# Altium project Control_Card.PrjPcb
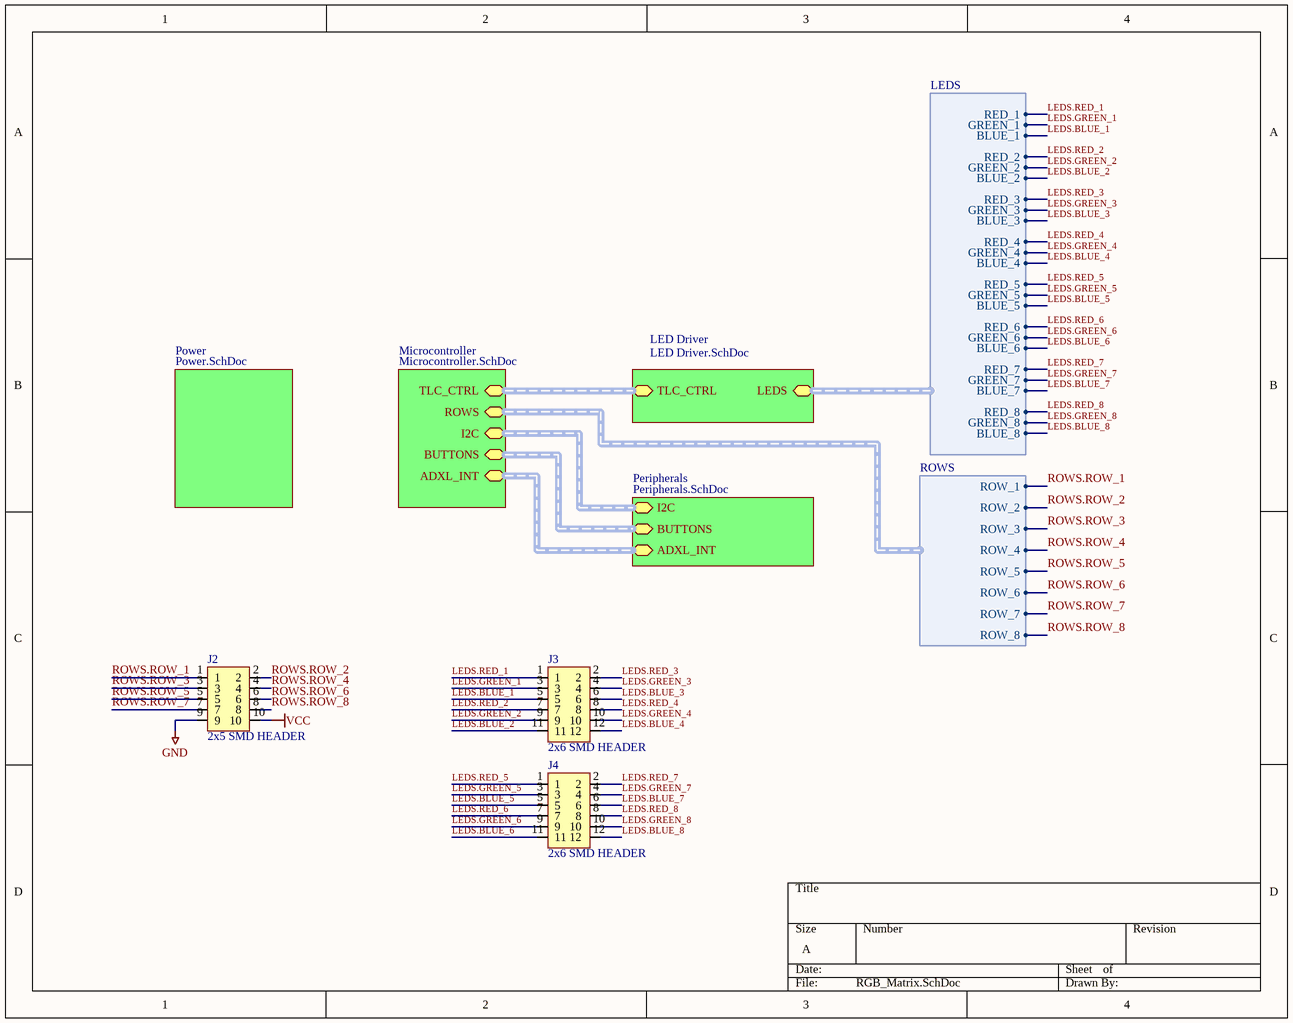
[diagram p0: RGB_Matrix.SchDoc]
4 sheets, 18 parts. Net scope: hierarchical (ports join the sheet entries above them; power ports are global).
Board file: RGB_Matrix.PcbDoc
Sheets:
  RGB_Matrix.SchDoc
    LED Driver = LED Driver.SchDoc
    Microcontroller = Microcontroller.SchDoc
    Power = Power.SchDoc

## Sheet RGB_Matrix.SchDoc
size A

### Parts
J2  2x5 SMD HEADER  [2x5 SMD HEADER]
J3  2x6 SMD HEADER  [2x6 SMD HEADER]
J4  2x6 SMD HEADER  [2x6 SMD HEADER]

### Sub-sheets
LED Driver = LED Driver.SchDoc: TLC_CTRL (harness TLC_CTRL), LEDS (harness LEDS)
Microcontroller = Microcontroller.SchDoc: TLC_CTRL (harness TLC_CTRL), ROWS (harness ROWS), I2C (harness I2C), ADXL_INT (harness ADXL_INT), BUTTONS (harness BUTTONS)
Peripherals = Peripherals.SchDoc (file not in this document): I2C (harness I2C), ADXL_INT (harness ADXL_INT), BUTTONS (harness BUTTONS)
Power = Power.SchDoc: no entries

### Harnesses
LEDS: BLUE_1, BLUE_2, BLUE_3, BLUE_4, BLUE_5, BLUE_6, BLUE_7, GREEN_1, GREEN_2, GREEN_3, GREEN_4, GREEN_5, GREEN_6, GREEN_7, GREEN_8, RED_1, RED_2, RED_3, RED_4, RED_5, RED_6, RED_7, RED_8, BLUE_8
ROWS: ROW_1, ROW_2, ROW_3, ROW_4, ROW_5, ROW_6, ROW_7, ROW_8

### Nets
GND: J2.9
VCC: J2.10
LEDS.BLUE_1: J3.5 ; sheet LED Driver/LEDS.BLUE_1
LEDS.BLUE_2: J3.11 ; sheet LED Driver/LEDS.BLUE_2
LEDS.BLUE_3: J3.6 ; sheet LED Driver/LEDS.BLUE_3
LEDS.BLUE_4: J3.12 ; sheet LED Driver/LEDS.BLUE_4
LEDS.BLUE_5: J4.5 ; sheet LED Driver/LEDS.BLUE_5
LEDS.BLUE_6: J4.11 ; sheet LED Driver/LEDS.BLUE_6
LEDS.BLUE_7: J4.6 ; sheet LED Driver/LEDS.BLUE_7
LEDS.BLUE_8: J4.12 ; sheet LED Driver/LEDS.BLUE_8
LEDS.GREEN_1: J3.3 ; sheet LED Driver/LEDS.GREEN_1
LEDS.GREEN_2: J3.9 ; sheet LED Driver/LEDS.GREEN_2
LEDS.GREEN_3: J3.4 ; sheet LED Driver/LEDS.GREEN_3
LEDS.GREEN_4: J3.10 ; sheet LED Driver/LEDS.GREEN_4
LEDS.GREEN_5: J4.3 ; sheet LED Driver/LEDS.GREEN_5
LEDS.GREEN_6: J4.9 ; sheet LED Driver/LEDS.GREEN_6
LEDS.GREEN_7: J4.4 ; sheet LED Driver/LEDS.GREEN_7
LEDS.GREEN_8: J4.10 ; sheet LED Driver/LEDS.GREEN_8
LEDS.RED_1: J3.1 ; sheet LED Driver/LEDS.RED_1
LEDS.RED_2: J3.7 ; sheet LED Driver/LEDS.RED_2
LEDS.RED_3: J3.2 ; sheet LED Driver/LEDS.RED_3
LEDS.RED_4: J3.8 ; sheet LED Driver/LEDS.RED_4
LEDS.RED_5: J4.1 ; sheet LED Driver/LEDS.RED_5
LEDS.RED_6: J4.7 ; sheet LED Driver/LEDS.RED_6
LEDS.RED_7: J4.2 ; sheet LED Driver/LEDS.RED_7
LEDS.RED_8: J4.8 ; sheet LED Driver/LEDS.RED_8
ROWS.ROW_1: J2.1 ; sheet Microcontroller/ROWS.ROW_1
ROWS.ROW_2: J2.2 ; sheet Microcontroller/ROWS.ROW_2
ROWS.ROW_3: J2.3 ; sheet Microcontroller/ROWS.ROW_3
ROWS.ROW_4: J2.4 ; sheet Microcontroller/ROWS.ROW_4
ROWS.ROW_5: J2.5 ; sheet Microcontroller/ROWS.ROW_5
ROWS.ROW_6: J2.6 ; sheet Microcontroller/ROWS.ROW_6
ROWS.ROW_7: J2.7 ; sheet Microcontroller/ROWS.ROW_7
ROWS.ROW_8: J2.8 ; sheet Microcontroller/ROWS.ROW_8

### Buses and harness runs
harness sheet LED Driver/TLC_CTRL = sheet Microcontroller/TLC_CTRL
harness sheet Microcontroller/ADXL_INT = sheet Peripherals/ADXL_INT
harness sheet Microcontroller/BUTTONS = sheet Peripherals/BUTTONS
harness sheet Microcontroller/I2C = sheet Peripherals/I2C

## Sheet LED Driver.SchDoc
size A4
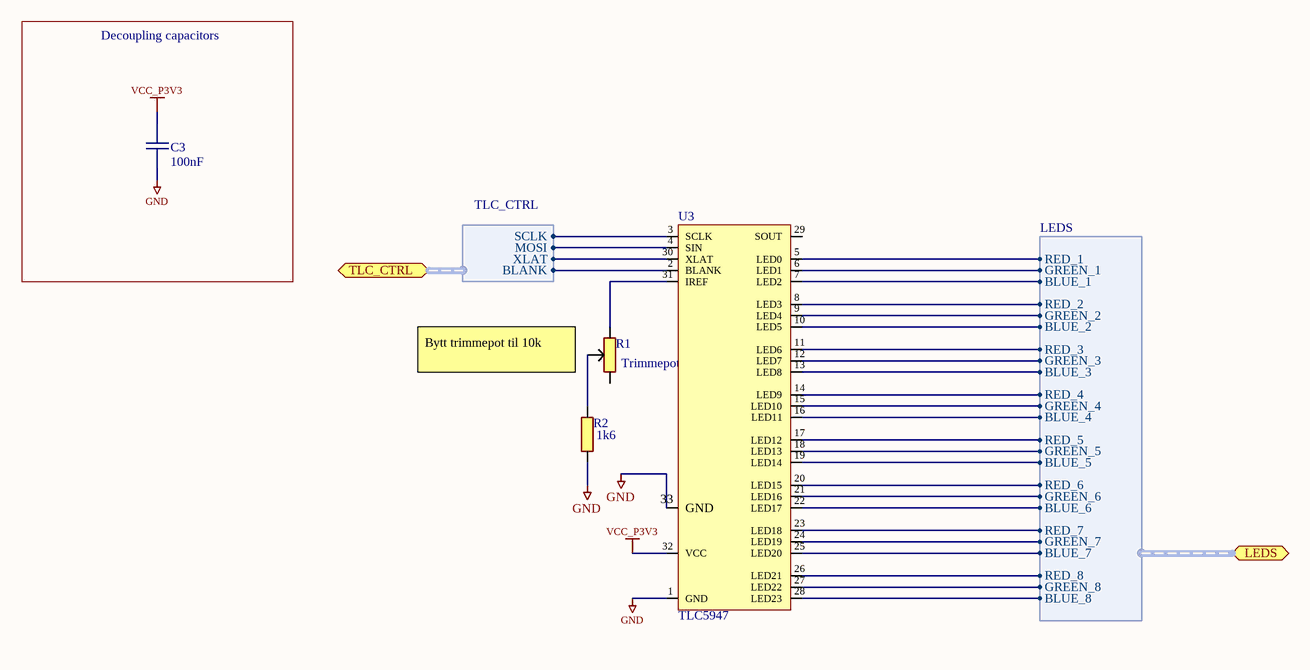
[diagram p1: LED Driver.SchDoc]

### Parts
C3  100nF  [CAPC0603(1608)55_N]
R1  Trimmepot 500ohm  [TRIMPOT_3006P]
R2  1k6  [RESC0603(1608)_N]
U3  TLC5947  [TLC5947]

### Blocks framed on the sheet
Decoupling capacitors: C3

### Ports
LEDS (harness LEDS), TLC_CTRL (harness TLC_CTRL)

### Harnesses
TLC_CTRL: SCLK, MOSI, XLAT, BLANK
LEDS: BLUE_1, BLUE_2, BLUE_3, BLUE_4, BLUE_5, BLUE_6, BLUE_7, GREEN_1, GREEN_2, GREEN_3, GREEN_4, GREEN_5, GREEN_6, GREEN_7, GREEN_8, RED_1, RED_2, RED_3, RED_4, RED_5, RED_6, RED_7, RED_8, BLUE_8

### Nets
GND: C3.1 R2.1 U3.1(GND) U3.33(GND)
VCC_P3V3: C3.2 U3.32(VCC)
LEDS.BLUE_1: U3.7(LED2) ; port LEDS.BLUE_1
LEDS.BLUE_2: U3.10(LED5) ; port LEDS.BLUE_2
LEDS.BLUE_3: U3.13(LED8) ; port LEDS.BLUE_3
LEDS.BLUE_4: U3.16(LED11) ; port LEDS.BLUE_4
LEDS.BLUE_5: U3.19(LED14) ; port LEDS.BLUE_5
LEDS.BLUE_6: U3.22(LED17) ; port LEDS.BLUE_6
LEDS.BLUE_7: U3.25(LED20) ; port LEDS.BLUE_7
LEDS.BLUE_8: U3.28(LED23) ; port LEDS.BLUE_8
LEDS.GREEN_1: U3.6(LED1) ; port LEDS.GREEN_1
LEDS.GREEN_2: U3.9(LED4) ; port LEDS.GREEN_2
LEDS.GREEN_3: U3.12(LED7) ; port LEDS.GREEN_3
LEDS.GREEN_4: U3.15(LED10) ; port LEDS.GREEN_4
LEDS.GREEN_5: U3.18(LED13) ; port LEDS.GREEN_5
LEDS.GREEN_6: U3.21(LED16) ; port LEDS.GREEN_6
LEDS.GREEN_7: U3.24(LED19) ; port LEDS.GREEN_7
LEDS.GREEN_8: U3.27(LED22) ; port LEDS.GREEN_8
LEDS.RED_1: U3.5(LED0) ; port LEDS.RED_1
LEDS.RED_2: U3.8(LED3) ; port LEDS.RED_2
LEDS.RED_3: U3.11(LED6) ; port LEDS.RED_3
LEDS.RED_4: U3.14(LED9) ; port LEDS.RED_4
LEDS.RED_5: U3.17(LED12) ; port LEDS.RED_5
LEDS.RED_6: U3.20(LED15) ; port LEDS.RED_6
LEDS.RED_7: U3.23(LED18) ; port LEDS.RED_7
LEDS.RED_8: U3.26(LED21) ; port LEDS.RED_8
NetR1_2: R1.2 R2.2
NetR1_3: R1.3 U3.31(IREF)
NetU1_14: U3.30(XLAT) ; port TLC_CTRL.XLAT
NetU1_15: U3.4(SIN) ; port TLC_CTRL.MOSI
NetU1_16: U3.2(BLANK) ; port TLC_CTRL.BLANK
NetU1_17: U3.3(SCLK) ; port TLC_CTRL.SCLK

Not connected (* = marked no-connect by the designer): R1 1; U3 29(SOUT)

### Notes on the sheet
- Bytt trimmepot til 10k
- Size:
- Date:
- Title:
- A3
- Revision:
- Sheet
- of
- Author:
- File:

### Library data of the parts
C3 = 3028: X7R 50V 5%; id: 3028; pakke_opprettet_av: 815; leverandor_varenr: 1759122; pris: 1; nokkelord: Kondensator, Capacitor, CAP; produsent: Multikomp; leverandor: Farnell; pakketype: 0603; pakke_opprettet: 18-Feb-15 2:18:13 PM; symbol_opprettet_av: 815; symbol_opprettet: 14-Nov-14 8:19:34 PM; navn: 100nF
R1 = 1365: 15 turn, horizontal; id: 1365; rad: 1; rom: OV; lager_type: Fremlager; dybde: 2; hylle: 7; antall: 50; pakke_opprettet_av: 815; leverandor_varenr: 9352376; pris: 15; nokkelord: trimpot; produsent: Bourns; leverandor: Farnell; pakketype: TH; kolonne: 1; pakke_opprettet: 2/10/2017 3:29:47 PM; symbol_opprettet_av: 815; symbol_opprettet: 11/3/2016 3:34:07 PM; navn: Trimmepot 500ohm
R2 = 3446: 0.1W 1% Thick film resistor; id: 3446; rad: -1; rom: OV; lager_type: Fremlager; dybde: 53; hylle: 6; antall: 100; kolonne: 0; pakke_opprettet_av: 815; pakketype: 0603; pakke_opprettet: 7/8/2014 9:15:30 PM; symbol_opprettet_av: 815; symbol_opprettet: 7/8/2014 9:16:33 PM; navn: 1k6; pris: 0

## Sheet Microcontroller.SchDoc
size A4
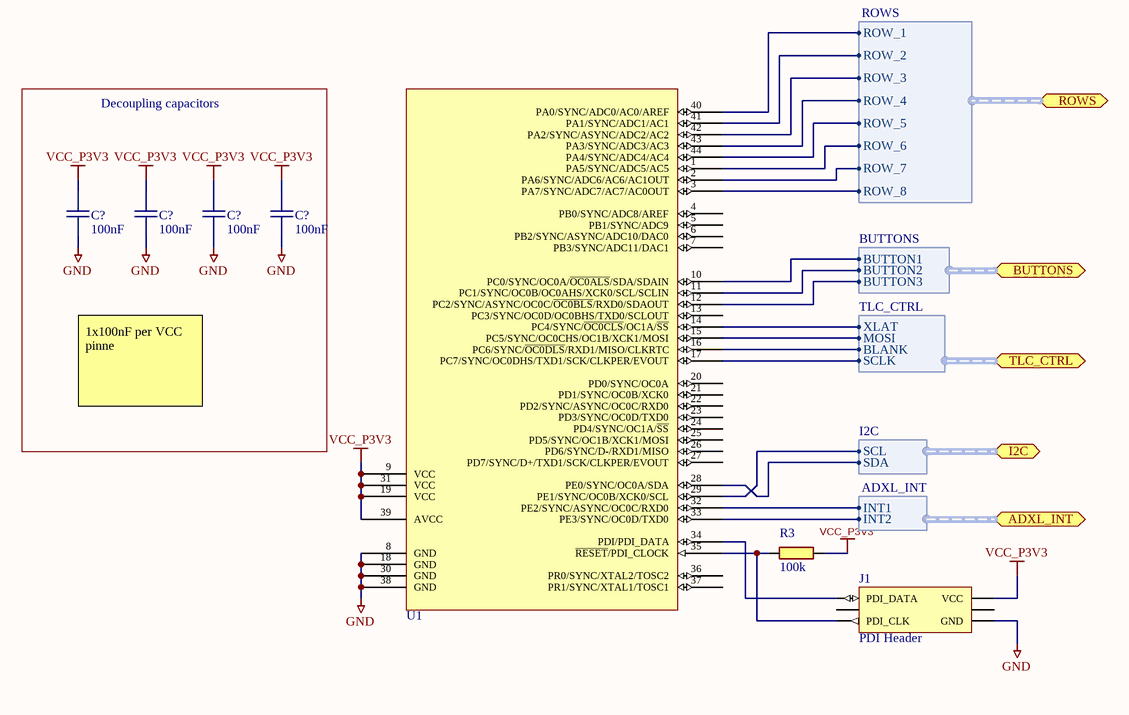
[diagram p2: Microcontroller.SchDoc]

### Parts
(Parts that share a designator on the sheet are numbered #1, #2 ... from top to bottom, then left to right.)
C?#1  100nF  [CAPC0603(1608)55_N]
C?#2  100nF  [CAPC0603(1608)55_N]
C?#3  100nF  [CAPC0603(1608)55_N]
C?#4  100nF  [CAPC0603(1608)55_N]
J1  PDI Header  [HEADER_3x2]
R3  100k  [RESC0603(1608)_N]
U1  ATXMEGA-A4U  [TQFP80P1200X1200X120-44N]  (value not drawn)

### Blocks framed on the sheet
Decoupling capacitors: C?#1-C?#4

### Ports
ADXL_INT (harness ADXL_INT), BUTTONS (harness BUTTONS), I2C (harness I2C), ROWS (harness ROWS), TLC_CTRL (harness TLC_CTRL)

### Harnesses
ROWS: ROW_1, ROW_2, ROW_3, ROW_4, ROW_5, ROW_6, ROW_7, ROW_8
TLC_CTRL: SCLK, MOSI, XLAT, BLANK
I2C: SCL, SDA
ADXL_INT: INT1, INT2
BUTTONS: BUTTON1, BUTTON2, BUTTON3

### Nets
GND: C?#1.1 C?#2.1 C?#3.1 C?#4.1 J1.6(GND) U1.8(GND) U1.18(GND) U1.30(GND) U1.38(GND)
VCC_P3V3: C?#1.2 C?#2.2 C?#3.2 C?#4.2 J1.2(VCC) R3.1 U1.9(VCC) U1.19(VCC) U1.31(VCC) U1.39(AVCC)
ROWS.ROW_1: U1.40(PA0/SYNC/ADC0/AC0/AREF) ; port ROWS.ROW_1
ROWS.ROW_2: U1.41(PA1/SYNC/ADC1/AC1) ; port ROWS.ROW_2
ROWS.ROW_3: U1.42(PA2/SYNC/ASYNC/ADC2/AC2) ; port ROWS.ROW_3
ROWS.ROW_4: U1.43(PA3/SYNC/ADC3/AC3) ; port ROWS.ROW_4
ROWS.ROW_5: U1.44(PA4/SYNC/ADC4/AC4) ; port ROWS.ROW_5
ROWS.ROW_6: U1.1(PA5/SYNC/ADC5/AC5) ; port ROWS.ROW_6
ROWS.ROW_7: U1.2(PA6/SYNC/ADC6/AC6/AC1OUT) ; port ROWS.ROW_7
ROWS.ROW_8: U1.3(PA7/SYNC/ADC7/AC7/AC0OUT) ; port ROWS.ROW_8
NetJ1_1: J1.1(PDI_DATA) U1.34(PDI/PDI_DATA)
NetJ1_5: J1.5(PDI_CLK) R3.2 U1.35(~{RESET}/PDI_CLOCK)
NetU1_10: U1.10(PC0/SYNC/OC0A/~{OC0ALS}/SDA/SDAIN) ; port BUTTONS.BUTTON1
NetU1_11: U1.11(PC1/SYNC/OC0B/OC0AHS/XCK0/SCL/SCLIN) ; port BUTTONS.BUTTON2
NetU1_12: U1.12(PC2/SYNC/ASYNC/OC0C/~{OC0BLS}/RXD0/SDAOUT) ; port BUTTONS.BUTTON3
NetU1_14: U1.14(PC4/SYNC/~{OC0CLS}/OC1A/~{SS}) ; port TLC_CTRL.XLAT
NetU1_15: U1.15(PC5/SYNC/OC0CHS/OC1B/XCK1/MOSI) ; port TLC_CTRL.MOSI
NetU1_16: U1.16(PC6/SYNC/~{OC0DLS}/RXD1/MISO/CLKRTC) ; port TLC_CTRL.BLANK
NetU1_17: U1.17(PC7/SYNC/OC0DHS/TXD1/SCK/CLKPER/EVOUT) ; port TLC_CTRL.SCLK
NetU1_28: U1.28(PE0/SYNC/OC0A/SDA) ; port I2C.SDA
NetU1_29: U1.29(PE1/SYNC/OC0B/XCK0/SCL) ; port I2C.SCL
NetU1_32: U1.32(PE2/SYNC/ASYNC/OC0C/RXD0) ; port ADXL_INT.INT1
NetU1_33: U1.33(PE3/SYNC/OC0D/TXD0) ; port ADXL_INT.INT2

Not connected (* = marked no-connect by the designer): J1 3 4; U1 4(PB0/SYNC/ADC8/AREF) 5(PB1/SYNC/ADC9) 6(PB2/SYNC/ASYNC/ADC10/DAC0) 7(PB3/SYNC/ADC11/DAC1) 13(PC3/SYNC/OC0D/OC0BHS/TXD0/SCLOUT) 20(PD0/SYNC/OC0A) 21(PD1/SYNC/OC0B/XCK0) 22(PD2/SYNC/ASYNC/OC0C/RXD0) 23(PD3/SYNC/OC0D/TXD0) 24(PD4/SYNC/OC1A/~{SS}) 25(PD5/SYNC/OC1B/XCK1/MOSI) 26(PD6/SYNC/D-/RXD1/MISO) 27(PD7/SYNC/D+/TXD1/SCK/CLKPER/EVOUT) 36(PR0/SYNC/XTAL2/TOSC2) 37(PR1/SYNC/XTAL1/TOSC1)

### Notes on the sheet
- 1x100nF per VCC pinne

### Library data of the parts
C?#1-C?#4 = 3028: as C3 on sheet LED Driver; pakke_opprettet: 18-Feb-15 2:18:13 PM; symbol_opprettet_av: 815; symbol_opprettet: 14-Nov-14 8:19:34 PM; navn: 100nF
J1 = 2407: PDI Xmega programming header; id: 2407
R3 = 2384: 0.1W 1% Thick film resistor; id: 2384; rad: -1; rom: OV; lager_type: Fremlager; dybde: 96; hylle: 6; antall: 100; kolonne: 0; pakke_opprettet_av: 815; pakketype: 0603; pakke_opprettet: 08.07.2014 21:15:30; symbol_opprettet_av: 815; symbol_opprettet: 08.07.2014 21:16:33; navn: 100k; pris: 0; nokkelord: Resistor
U1 = 2103: id: 2103; rad: 4; rom: OV; lager_type: Fremlager; dybde: 0; antall: 82; kolonne: 2; pakke_opprettet_av: 774; beskrivelse: Mikrokontroller; navn: ATXMEGA64A4U-AU; produsent: Atmel; pakketype: TQFP; hylle: 0; pakke_opprettet: 8/22/2014 2:00:28 PM; symbol_opprettet_av: 774; symbol_opprettet: 8/22/2014 2:00:55 PM; pris: 0

## Sheet Power.SchDoc
size A
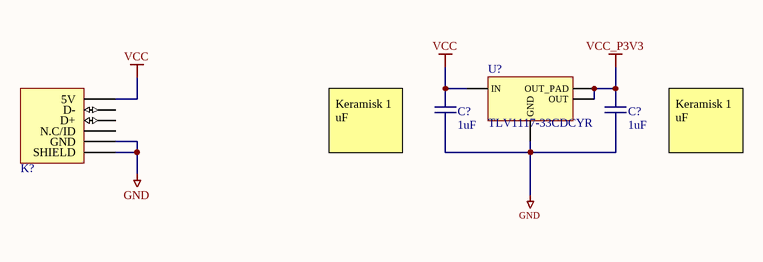
[diagram p3: Power.SchDoc]

### Parts
(Parts that share a designator on the sheet are numbered #1, #2 ... from top to bottom, then left to right.)
C?#5  1uF  [CAPC0805(2012)100_N]
C?#6  1uF  [CAPC0805(2012)100_N]
K?  USB_CONNECTOR_5P  [105017-0001]  (value not drawn)
U?  TLV1117-33CDCYR  [SOT230P700X180-4N]

### Nets
GND: C?#5.1 C?#6.1 K?.0(SHIELD) K?.5(GND) U?.1(GND)
VCC: C?#5.2 K?.1(5V) U?.3(IN)
VCC_P3V3: C?#6.2 U?.2(OUT_PAD) U?.4(OUT)

Not connected (* = marked no-connect by the designer): K? 2(D-) 3(D+) 4(N.C/ID)

### Notes on the sheet
- (near C?#5) Keramisk 1 uF
- (near C?#6) Keramisk 1 uF

### Library data of the parts
C?#5 C?#6 = 3582: X7R 50V 10%; id: 3582; pakke_opprettet_av: 815; leverandor_varenr: 1735541; pris: 4; nokkelord: Kondensator, capacitor; produsent: Murata; leverandor: Farnell; pakketype: 0805; pakke_opprettet: 14-Nov-14 8:52:01 PM; symbol_opprettet_av: 815; symbol_opprettet: 14-Nov-14 8:19:34 PM; navn: 1uF
K? = 4034: Micro USB Type B; id: 4034; pakke_opprettet_av: 1335; symbol_opprettet_av: 924; leverandor_varenr: 2293836; navn: USB Micro; pris: 0; nokkelord: USB Connector, Micro USB Type B, USB 2.0, Receptacle, 5 Ways, Surface Mount, Right Angle; leverandor: Farnell; pakketype: SMD; pakke_opprettet: 21-Feb-17 11:55:20 PM; symbol_opprettet: 30-Jul-15 6:06:06 PM
U? = 2386: 3,3V Low dropout regulator; id: 2386; rad: 2; rom: OV; lager_type: Fremlager; dybde: 0; hylle: 9; antall: 63; pakke_opprettet_av: 774; leverandor_varenr: 2447986; pris: 5; nokkelord: ldo; produsent: Texas Instruments; leverandor: Farnell; pakketype: SOT; kolonne: 0; pakke_opprettet: 7/11/2014 10:00:23 PM; symbol_opprettet_av: 774; symbol_opprettet: 7/11/2014 10:01:42 PM; navn: TLV1117-33CDCYR

## Nets that join several sheets
GND: RGB_Matrix (J2.9), LED Driver (C3.1 R2.1 U3.1 U3.33), Microcontroller (9 pins), Power (5 pins)
VCC: RGB_Matrix (J2.10), Power (C?#5.2 K?.1 U?.3)
VCC_P3V3: LED Driver (C3.2 U3.32), Microcontroller (10 pins), Power (C?#6.2 U?.2 U?.4)
LEDS.BLUE_1: RGB_Matrix (J3.5), LED Driver (U3.7)
LEDS.BLUE_2: RGB_Matrix (J3.11), LED Driver (U3.10)
LEDS.BLUE_3: RGB_Matrix (J3.6), LED Driver (U3.13)
LEDS.BLUE_4: RGB_Matrix (J3.12), LED Driver (U3.16)
LEDS.BLUE_5: RGB_Matrix (J4.5), LED Driver (U3.19)
LEDS.BLUE_6: RGB_Matrix (J4.11), LED Driver (U3.22)
LEDS.BLUE_7: RGB_Matrix (J4.6), LED Driver (U3.25)
LEDS.BLUE_8: RGB_Matrix (J4.12), LED Driver (U3.28)
LEDS.GREEN_1: RGB_Matrix (J3.3), LED Driver (U3.6)
LEDS.GREEN_2: RGB_Matrix (J3.9), LED Driver (U3.9)
LEDS.GREEN_3: RGB_Matrix (J3.4), LED Driver (U3.12)
LEDS.GREEN_4: RGB_Matrix (J3.10), LED Driver (U3.15)
LEDS.GREEN_5: RGB_Matrix (J4.3), LED Driver (U3.18)
LEDS.GREEN_6: RGB_Matrix (J4.9), LED Driver (U3.21)
LEDS.GREEN_7: RGB_Matrix (J4.4), LED Driver (U3.24)
LEDS.GREEN_8: RGB_Matrix (J4.10), LED Driver (U3.27)
LEDS.RED_1: RGB_Matrix (J3.1), LED Driver (U3.5)
LEDS.RED_2: RGB_Matrix (J3.7), LED Driver (U3.8)
LEDS.RED_3: RGB_Matrix (J3.2), LED Driver (U3.11)
LEDS.RED_4: RGB_Matrix (J3.8), LED Driver (U3.14)
LEDS.RED_5: RGB_Matrix (J4.1), LED Driver (U3.17)
LEDS.RED_6: RGB_Matrix (J4.7), LED Driver (U3.20)
LEDS.RED_7: RGB_Matrix (J4.2), LED Driver (U3.23)
LEDS.RED_8: RGB_Matrix (J4.8), LED Driver (U3.26)
NetU1_14: LED Driver (U3.30), Microcontroller (U1.14)
NetU1_15: LED Driver (U3.4), Microcontroller (U1.15)
NetU1_16: LED Driver (U3.2), Microcontroller (U1.16)
NetU1_17: LED Driver (U3.3), Microcontroller (U1.17)
ROWS.ROW_1: RGB_Matrix (J2.1), Microcontroller (U1.40)
ROWS.ROW_2: RGB_Matrix (J2.2), Microcontroller (U1.41)
ROWS.ROW_3: RGB_Matrix (J2.3), Microcontroller (U1.42)
ROWS.ROW_4: RGB_Matrix (J2.4), Microcontroller (U1.43)
ROWS.ROW_5: RGB_Matrix (J2.5), Microcontroller (U1.44)
ROWS.ROW_6: RGB_Matrix (J2.6), Microcontroller (U1.1)
ROWS.ROW_7: RGB_Matrix (J2.7), Microcontroller (U1.2)
ROWS.ROW_8: RGB_Matrix (J2.8), Microcontroller (U1.3)